# EasyEDA Pro project ProPrj_table-monitor_2025-05-22.epro, schematic Schematic1

## Sheets
1 USBC: Board Name: MainBoard; Create Date: 2025-04-15; Page Name: USBC; Project Name: table-monitor; Schematic Name: Schematic1; Update Date: 2025-04-30; Company: 嘉立创EDA; Page Size: A4; Version: V1.0
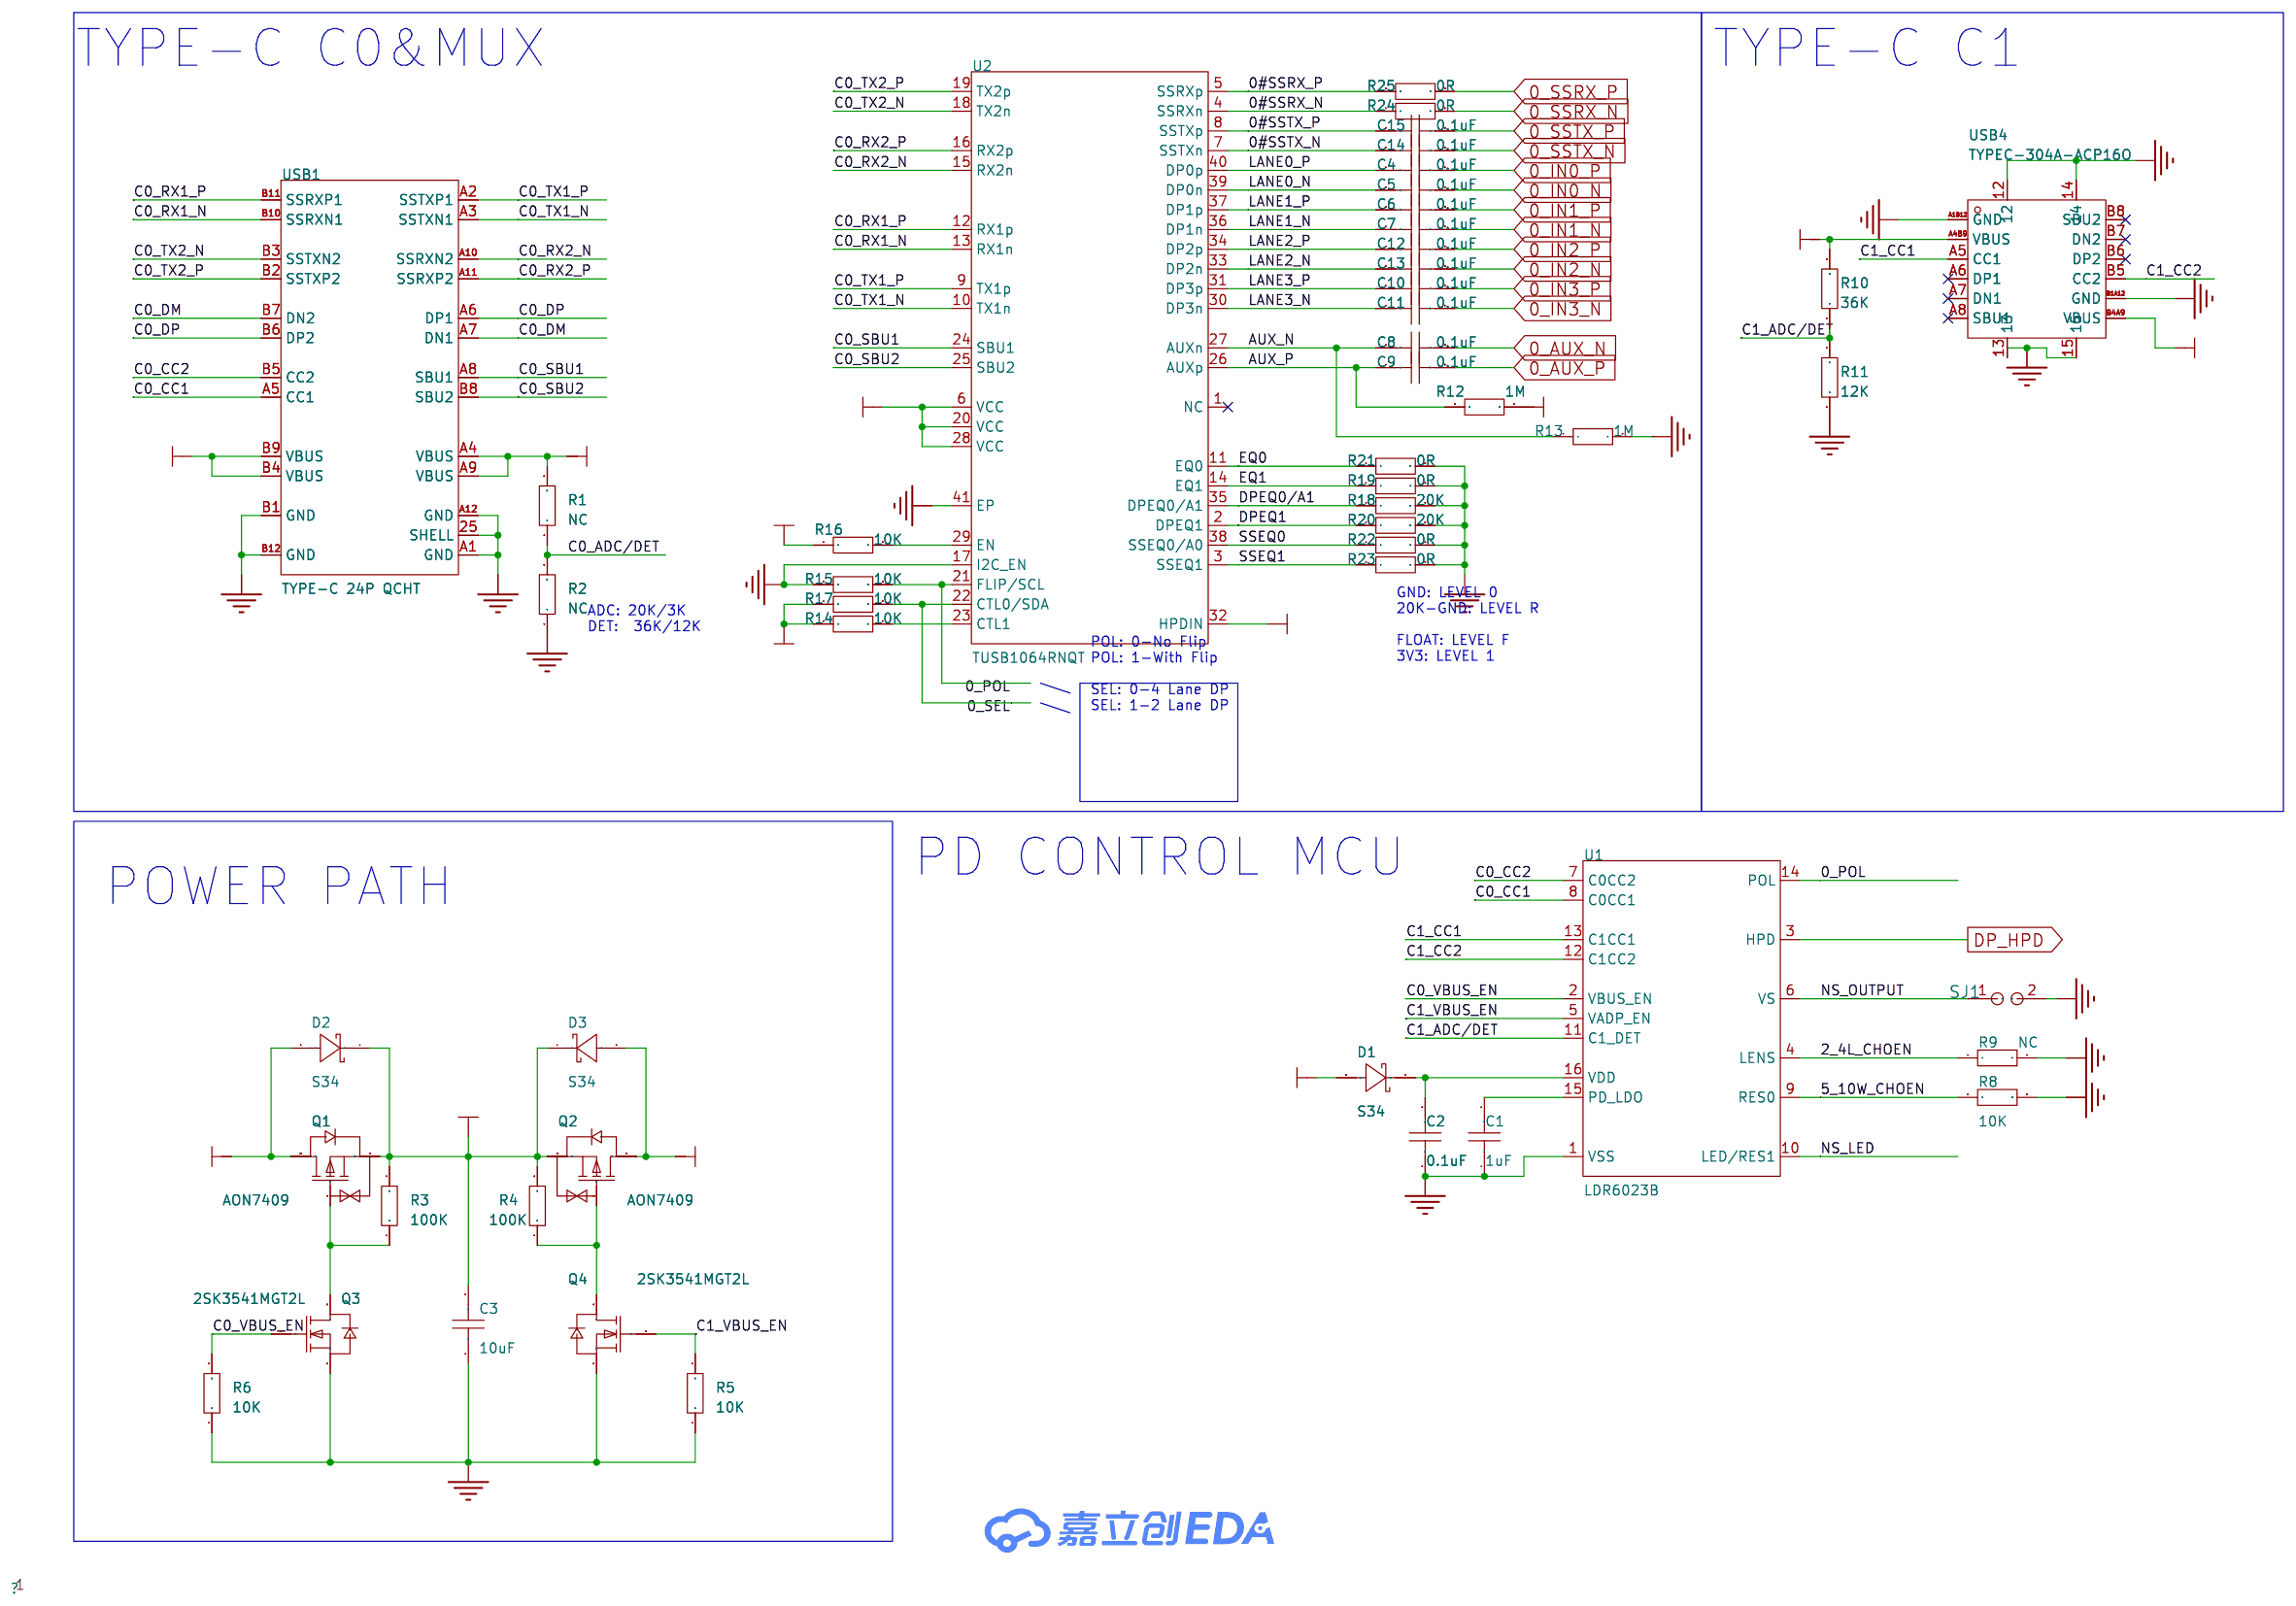
[diagram p1: USBC]
2 DP-MIPI: Create Date: 2025-04-22; Page Name: DP-MIPI
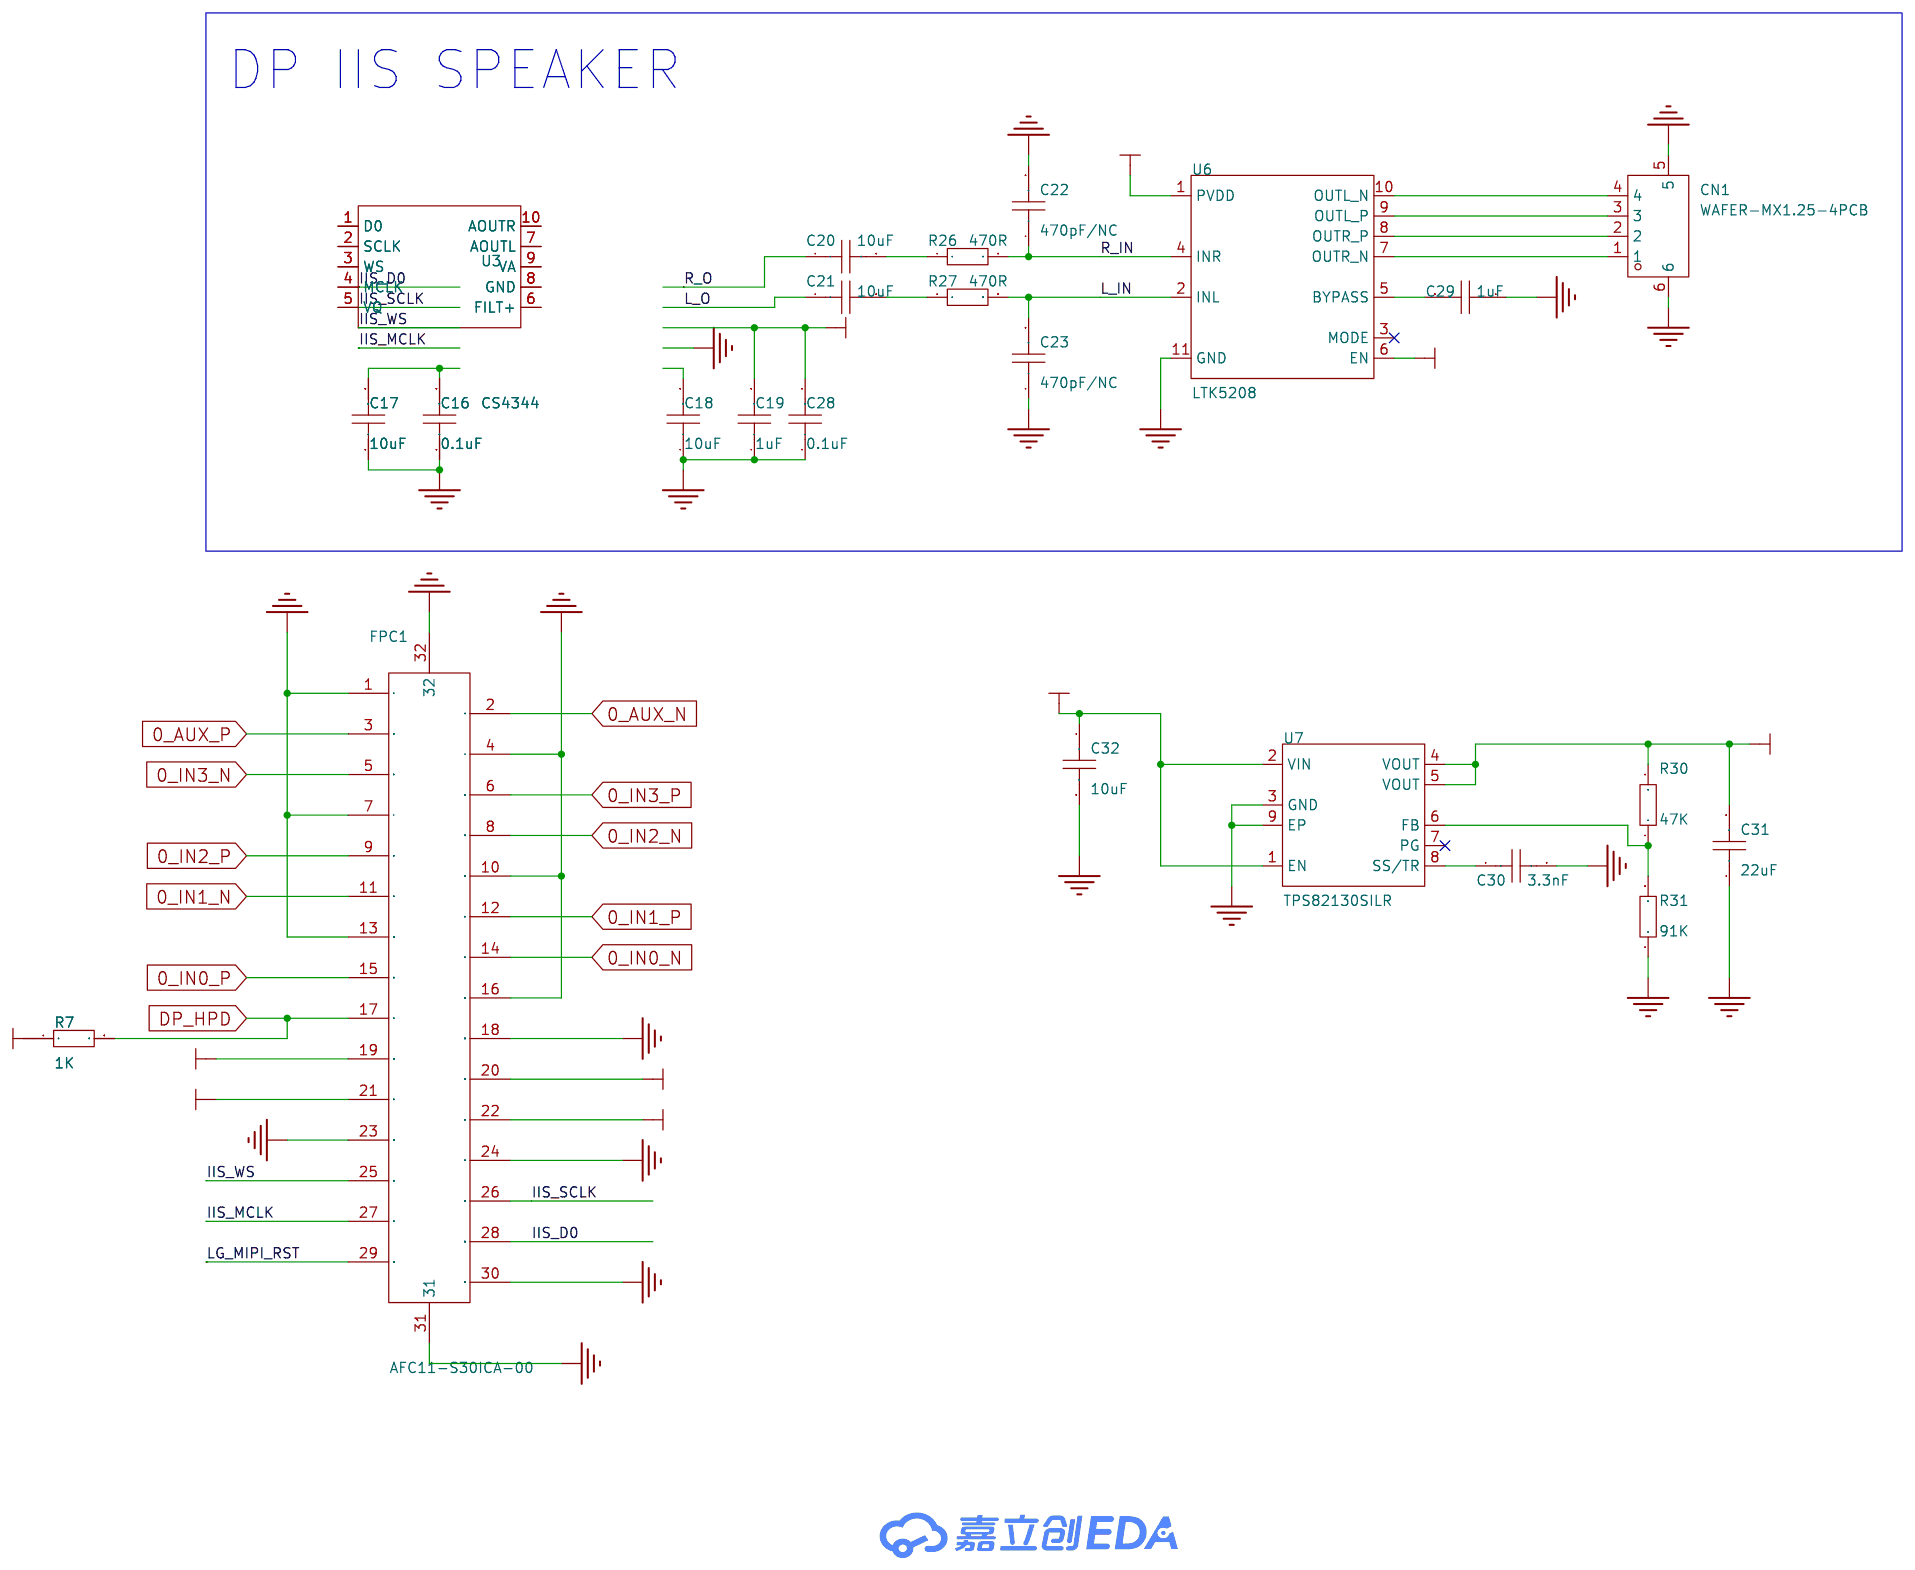
[diagram p2: DP-MIPI]
3 HUB: Create Date: 2025-04-22; Page Name: HUB; Update Date: 2025-05-07
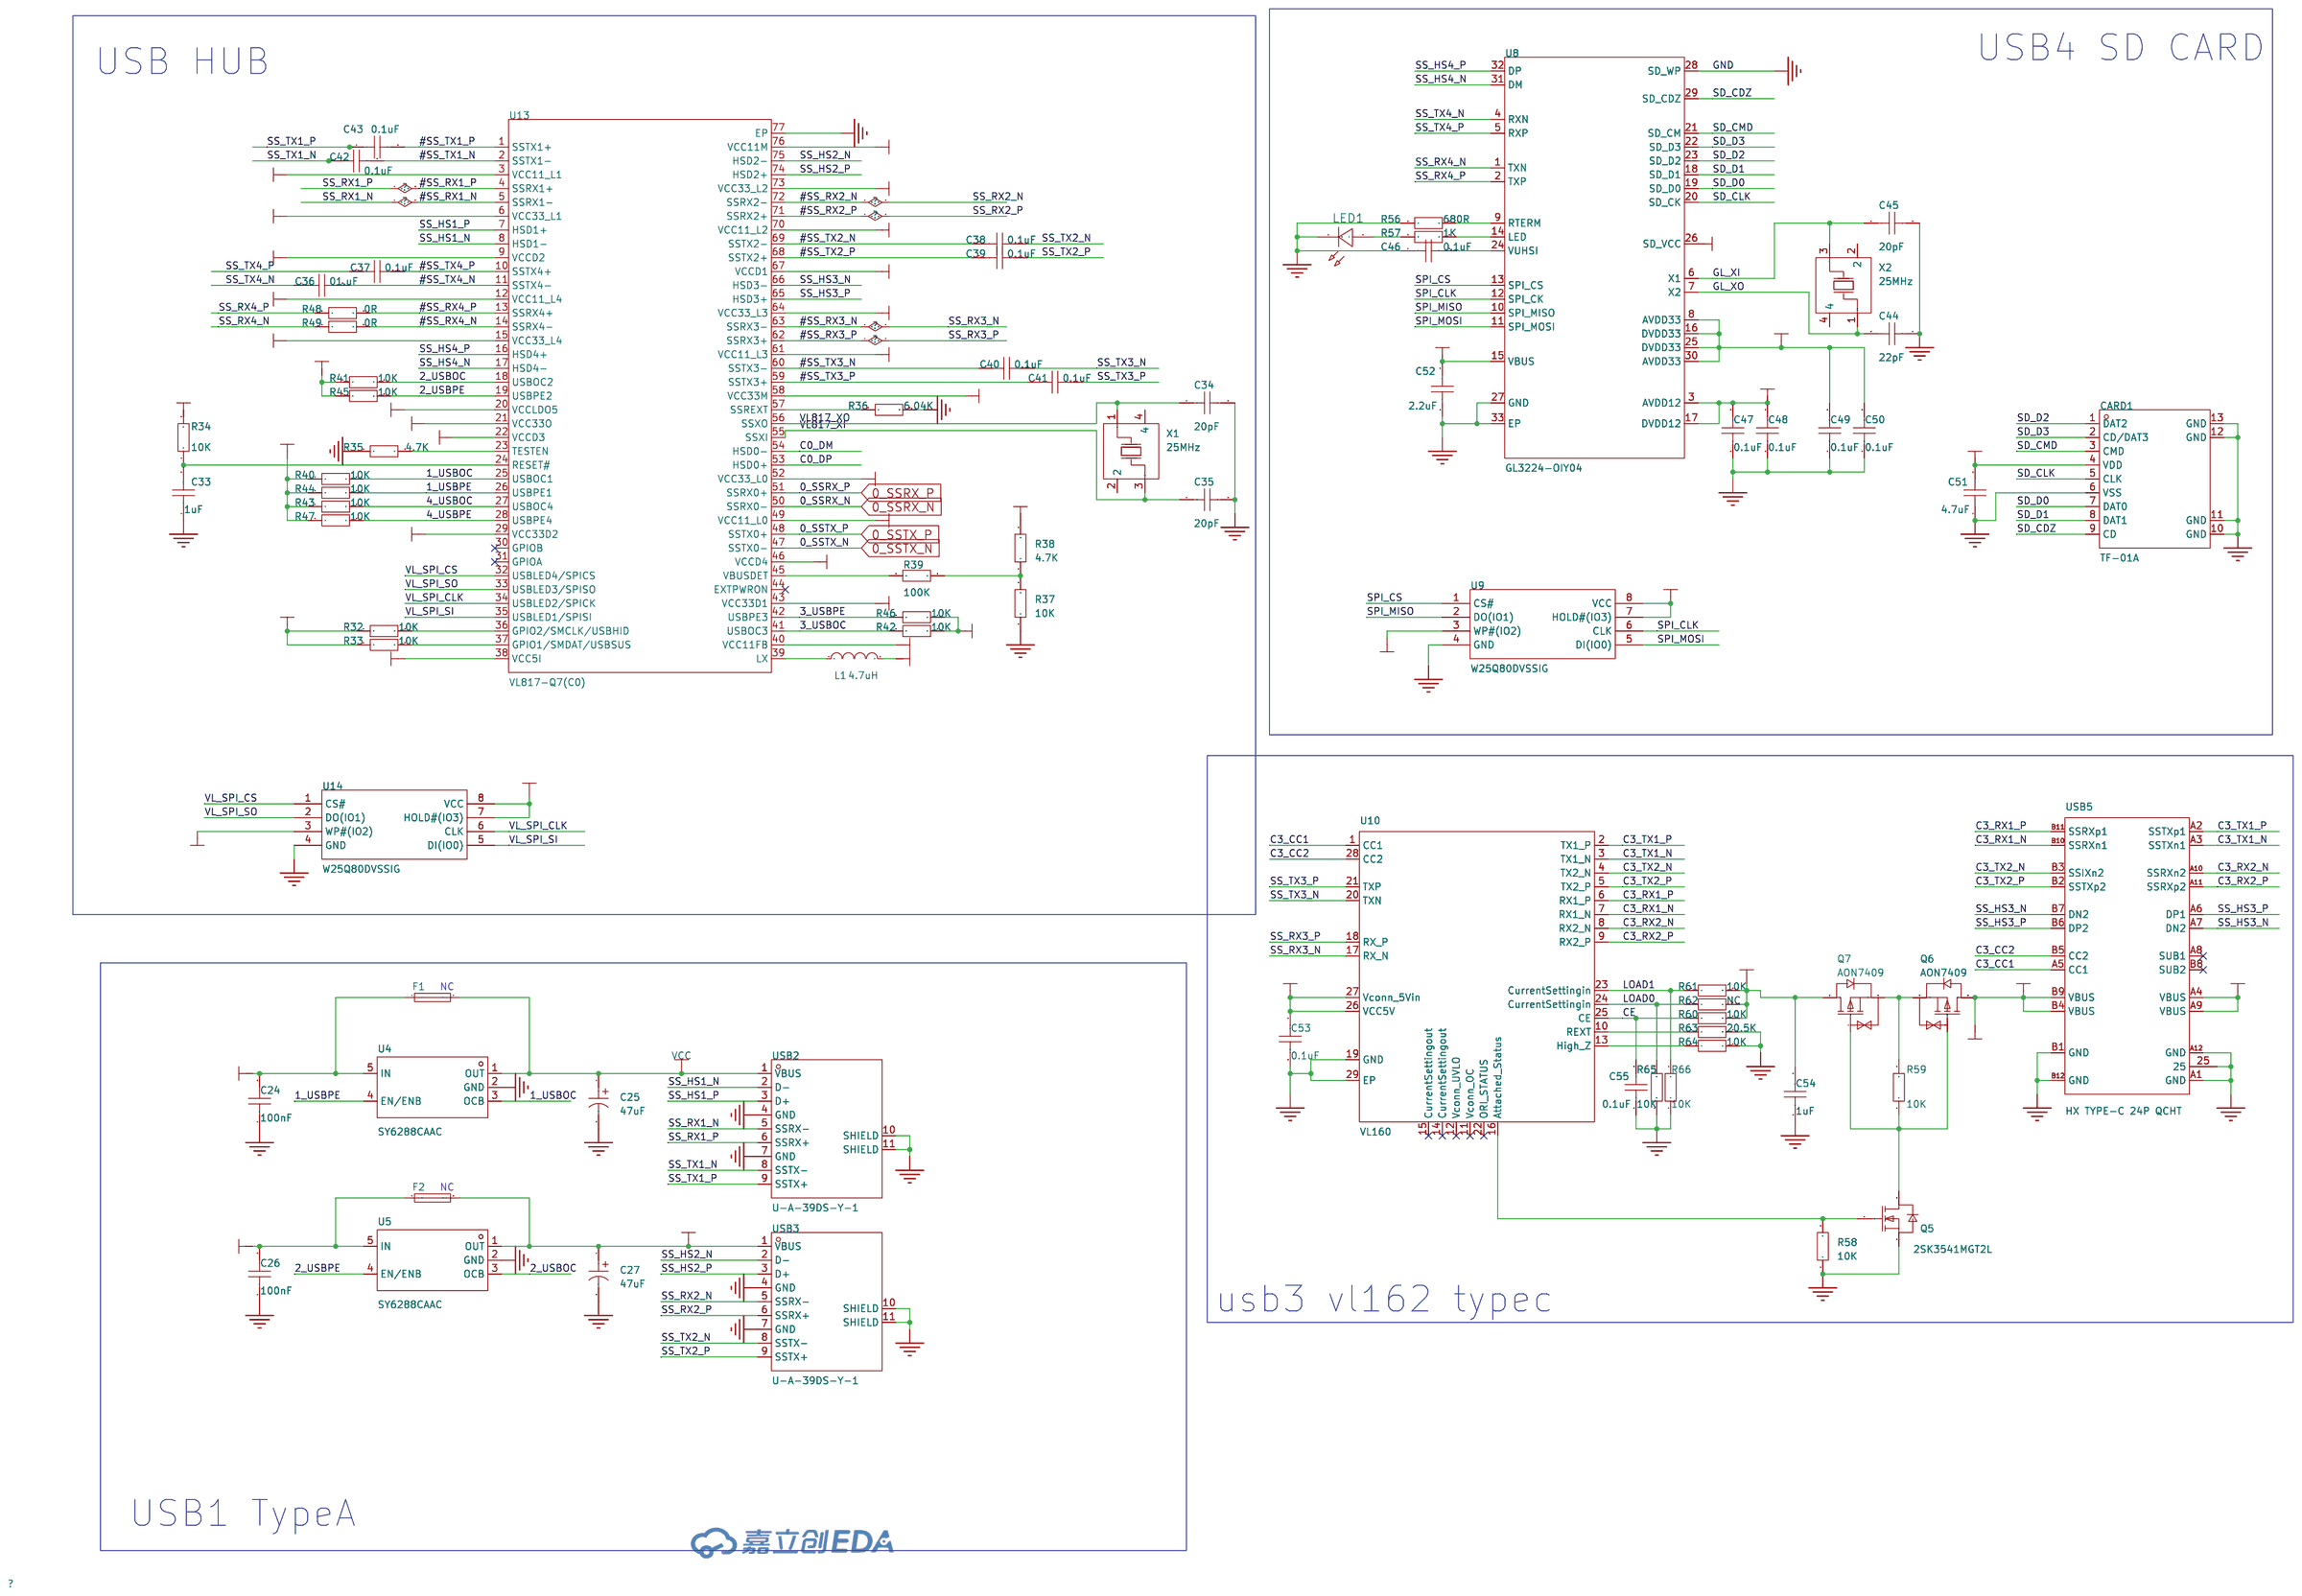
[diagram p3: HUB]
4 POWER: Create Date: 2025-04-22; Page Name: POWER
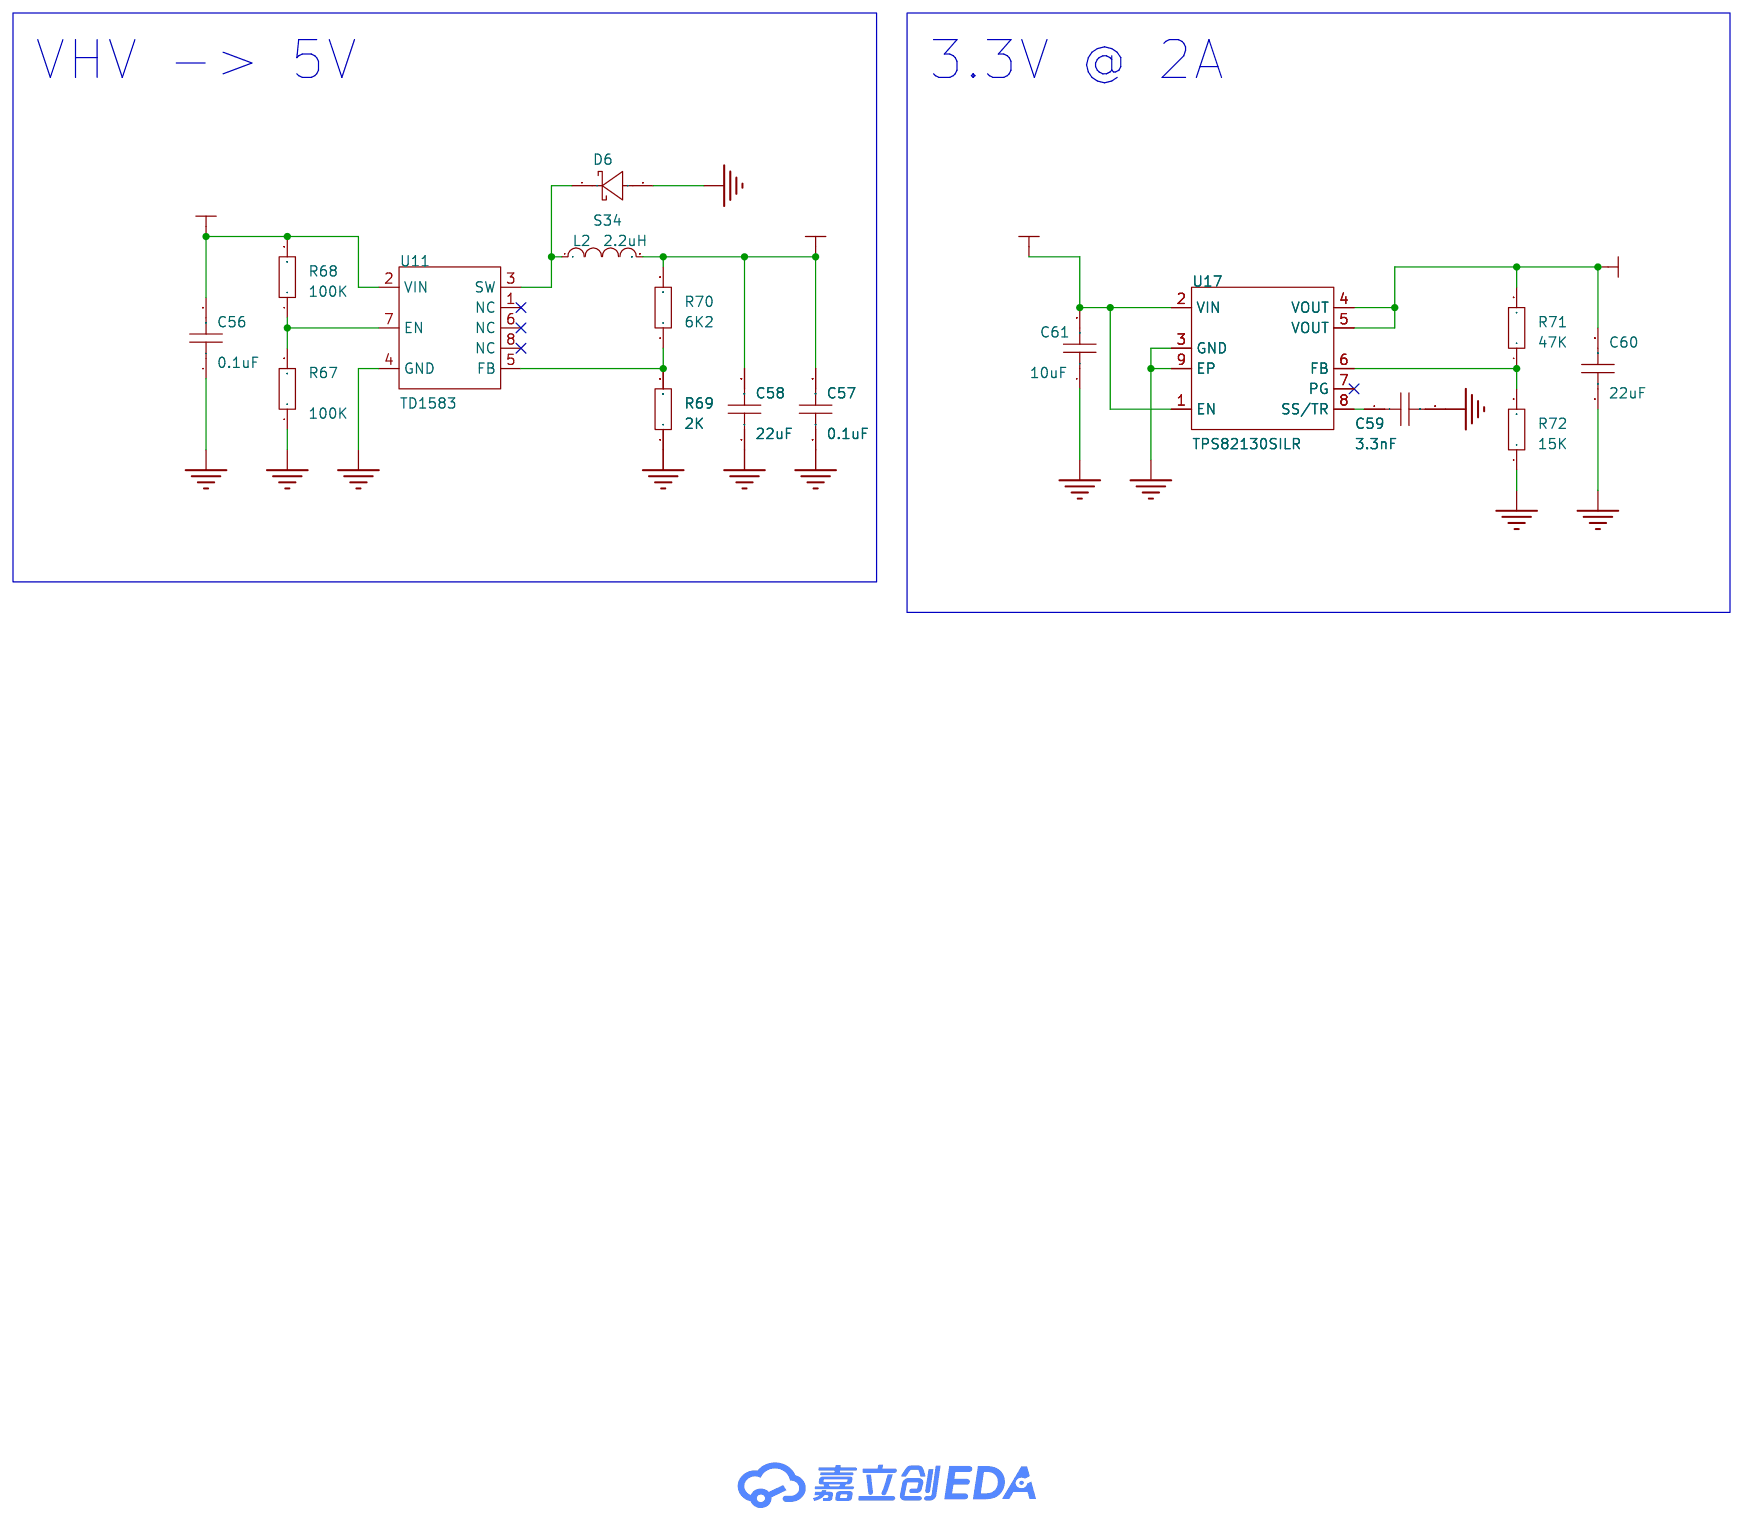
[diagram p4: POWER]

## Parts
sheet DP-MIPI
C16  0.1uF  [C0402]
C17  10uF  [C0402]
C18  10uF  [C0603]
C19  1uF  [C0603]
C20  10uF  [C0402]
C21  10uF  [C0402]
C22  470pF/NC  [C0402]
C23  470pF/NC  [C0402]
C28  0.1uF  [C0402]
C29  1uF  [C0402]
C30  3.3nF  [C0402]
C31  22uF  [C0805]
C32  10uF  [C0805]
CN1  WAFER-MX1.25-4PCB  [CONN-SMD_4P-P1.25_A1253WR-S-04PD01]
FPC1  AFC11-S30ICA-00  [CONN-SMD-30P_AFC11-S30ICA-00]
R7  1K  [R0603]
R26  470R  [R0402]
R27  470R  [R0402]
R30  47K  [R0402]
R31  91K  [R0402]
U3  CS4344  [TSSOP-10_L3.0-W3.0-P0.50-LS4.9-BL]
U6  LTK5208  [ESOP-10_L4.9-W3.9-P1.00-LS6.1-BL-EP]
U7  TPS82130SILR  [USIP-8_L3.0-W2.8-P0.65-TL-EP]
sheet HUB
C24  100nF  [C0402]
C25  47uF  [CAP-SMD_L3.5-W2.8-FD]
C26  100nF  [C0402]
C27  47uF  [CAP-SMD_L3.5-W2.8-FD]
C33  1uF  [C0402]
C34  20pF  [C0402]
C35  20pF  [C0402]
C36  01.uF  [C0402]
C37  0.1uF  [C0402]
C38  0.1uF  [C0402]
C39  0.1uF  [C0402]
C40  0.1uF  [C0402]
C41  0.1uF  [C0402]
C42  0.1uF  [C0402]
C43  0.1uF  [C0402]
C44  22pF  [C0402]
C45  20pF  [C0402]
C46  0.1uF  [C0402]
C47  0.1uF  [C0402]
C48  0.1uF  [C0402]
C49  0.1uF  [C0402]
C50  0.1uF  [C0402]
C51  4.7uF  [C0402]
C52  2.2uF  [C0402]
C53  0.1uF  [C0402]
C54  1uF  [C0603]
C55  0.1uF  [C0402]
CARD1  TF-01A  [TF-SMD_TF-02]
F1  -  [F1812]
F2  -  [F1812]
L1  4.7uH  [IND-SMD_L2.5-W2.0]
LED1  -  [LED_0603]
Q5  2SK3541MGT2L  [SOT-723-3_L1.2-W0.8-P0.80-LS1.2-BR]
Q6  AON7409  [DFN-8_L3.0-W3.0-P0.65-BL]
Q7  AON7409  [DFN-8_L3.0-W3.0-P0.65-BL]
R32  10K  [R0402]
R33  10K  [R0402]
R34  10K  [R0402]
R35  4.7K  [R0402]
R36  6.04K  [R0402]
R37  10K  [R0402]
R38  4.7K  [R0402]
R39  100K  [R0402]
R40  10K  [R0402]
R41  10K  [R0402]
R42  10K  [R0402]
R43  10K  [R0402]
R44  10K  [R0402]
R45  10K  [R0402]
R46  10K  [R0402]
R47  10K  [R0402]
R48  0R  [R0402]
R49  0R  [R0402]
R56  680R  [R0402]
R57  1K  [R0402]
R58  10K  [R0402]
R59  10K  [R0402]
R60  10K  [R0402]
R61  10K  [R0402]
R62  NC  [R0402]
R63  20.5K  [R0402]
R64  10K  [R0402]
R65  10K  [R0402]
R66  10K  [R0402]
U4  SY6288CAAC  [SOT-23-5_L3.0-W1.7-P0.95-LS2.8-BR]
U5  SY6288CAAC  [SOT-23-5_L3.0-W1.7-P0.95-LS2.8-BR]
U8  GL3224-OIY04  [HQFN-32_L5.0-W5.0-P0.50-BL-EP3.0]
U9  W25Q80DVSSIG  [SOIC-8_L5.3-W5.3-P1.27-LS8.0-BL]
U10  VL160  [MQFN-28_L4.5-W3.5-P0.40-BL-EP]
U13  VL817-Q7(C0)  [QFN-76_L9.0-W9.0-P0.40-EP6.3-TL]
U14  W25Q80DVSSIG  [SOIC-8_L4.9-W3.9-P1.27-LS6.0-BL]
USB2  U-A-39DS-Y-1  [USB-3.0-SMD_U-A-39DS-Y-1]
USB3  U-A-39DS-Y-1  [USB-3.0-SMD_U-A-39DS-Y-1]
USB5  HX TYPE-C 24P QCHT  [TYPE-C-SMD_TYPE-C-24P-QCHT]
X1  25MHz  [CRYSTAL-SMD_4P-L2.5-W2.0-BL]
X2  25MHz  [CRYSTAL-SMD_4P-L2.5-W2.0-BL]
sheet POWER
C56  0.1uF  [C0402]
C57  0.1uF  [C0402]
C58  22uF  [C0402]
C59  3.3nF  [C0402]
C60  22uF  [C0805]
C61  10uF  [C0805]
D6  S34  [SOD-123FL_L2.7-W1.8-LS3.8-RD]
L2  2.2uH  [IND-SMD_L4.5-W4.0_SCD0403T]
R67  100K  [R0402]
R68  100K  [R0402]
R69  2K  [R0402]
R70  6K2  [R0402]
R71  47K  [R0402]
R72  15K  [R0402]
U11  TD1583  [SOP-8_L4.9-W3.9-P1.27-LS6.0-BL]
U17  TPS82130SILR  [USIP-8_L3.0-W2.8-P0.65-TL-EP]
sheet USBC
C1  1uF  [C0402]
C2  0.1uF  [C0402]
C3  10uF  [C0402]
C4  0.1uF  [C0402]
C5  0.1uF  [C0402]
C6  0.1uF  [C0402]
C7  0.1uF  [C0402]
C8  0.1uF  [C0402]
C9  0.1uF  [C0402]
C10  0.1uF  [C0402]
C11  0.1uF  [C0402]
C12  0.1uF  [C0402]
C13  0.1uF  [C0402]
C14  0.1uF  [C0402]
C15  0.1uF  [C0402]
D1  S34  [SOD-123FL_L2.7-W1.8-LS3.8-RD]
D2  S34  [SOD-123FL_L2.7-W1.8-LS3.8-RD]
D3  S34  [SOD-123FL_L2.7-W1.8-LS3.8-RD]
Q1  AON7409  [DFN-8_L3.0-W3.0-P0.65-BL]
Q2  AON7409  [DFN-8_L3.0-W3.0-P0.65-BL]
Q3  2SK3541MGT2L  [SOT-723-3_L1.2-W0.8-P0.80-LS1.2-BR]
Q4  2SK3541MGT2L  [SOT-723-3_L1.2-W0.8-P0.80-LS1.2-BR]
R1  NC  [R0402]
R2  NC  [R0402]
R3  100K  [R0402]
R4  100K  [R0402]
R5  10K  [R0402]
R6  10K  [R0402]
R8  10K  [R0402]
R9  NC  [R0402]
R10  36K  [R0402]
R11  12K  [R0402]
R12  1M  [R0402]
R13  1M  [R0402]
R14  10K  [R0402]
R15  10K  [R0402]
R16  10K  [R0402]
R17  10K  [R0402]
R18  20K  [R0402]
R19  0R  [R0402]
R20  20K  [R0402]
R21  0R  [R0402]
R22  0R  [R0402]
R23  0R  [R0402]
R24  0R  [R0402]
R25  0R  [R0402]
SJ1  -  [TOGO_MODE]
U1  LDR6023B  [SSOP-16_L5.0-W4.4-P0.65-LS6.4-BL]
U2  TUSB1064RNQT  [WQFN-40_L6.0-W4.0-P0.40-TL-EP]
USB1  TYPE-C 24P QCHT  [TYPE-C-SMD_TYPE-C-24P-QCHT]
USB4  TYPEC-304A-ACP16O  [USB-SMD_TYPEC-304A-ACP16O]

## Library data of the parts
C1-C24 C26 C28-C61 = CAP_0603: Supplier Footprint: 0603
CN1 = WAFER-MX1.25-4PCB: 插针结构:1x4P;间距:1.25mm;安装方式:卧贴;总PIN数:4P;排数:1;每排PIN数:4;额定电流:1A;工作温度范围:-25℃~+85℃;; LCSC Part Name: 1x4P 间距:1.25mm 卧贴 黑金; Supplier Part: C3029388; Manufacturer: XUNPU(讯普); Supplier Footprint: SMD,P=1.25mm,卧贴; JLCPCB Part Class: Extended Part; Datasheet: https://atta.szlcsc.com/upload/public/pdf/source/20220527/DF508E36F492A21EC16A4954092B1486.pdf; Supplier: LCSC; Pins Structure: 1x4P; Pitch: 1.25mm; Mounting Style: 卧贴; Number of Pins: 4P; Number of Rows: 1; Number of PINs Per Row: 4; Current Rating (Max): 1A; Operating Temperature Range: -25℃~+85℃
FPC1 = AFC11-S30ICA-00: 锁定特性:抽屉式;触点类型:单侧触点/垂直;触点数量:30P;间距:0.5mm;安装类型:立贴;; LCSC Part Name: 间距:0.5mm P数:30P 抽屉式 单侧触点/垂直; Supplier Part: C262505; Manufacturer: JS(钜硕电子); Supplier Footprint: SMD,P=0.5mm; JLCPCB Part Class: 扩展库; Datasheet: https://atta.szlcsc.com/upload/public/pdf/source/20191211/C466537_F6F2472ADACFFA77E875AFE9DAB8E0AD.pdf; Supplier: LCSC; Locking Feature: 抽屉式; Contact Type: 单侧触点/垂直; Number of Contacts: 30P; Pitch: 0.5mm; Mounting Type: 立贴; FFC, FCB Thickness: 0.3mm; Height Above Board: 4.4mm
R1-R27 R30-R49 R56-R72 = Res_0603: Supplier Footprint: 0603
U3 = CS4344: Supplier: LCSC; Supplier Part: C2914311; JLCPCB Part Class: Extended Part
U6 = LTK5208: Supplier: LCSC; Supplier Part: C2920780; Supplier Footprint: ESOP-10-EP-150mil; JLCPCB Part Class: Extended Part
U7 U17 = TPS82130: 输入电压(DC):3V~17V;输出电压:900mV~6V;输出电流(最大值):3A;功能类型:-;; Supplier: LCSC; Supplier Part: C473914; Manufacturer: TI(德州仪器); JLCPCB Part Class: Extended Part; Supplier Footprint: USIP-8; Datasheet: https://www.ti.com/cn/lit/gpn/tps82130; Input Voltage(DC): 3V~17V; Output Voltage: 900mV~6V; Output Current (Max): 3A; Output Channel: 1
C25 C27 = CA45A-B-16V-47UF-M: 容值:47uF;精度:±20%;额定电压:16V;工作温度:-55℃~+125℃;; LCSC Part Name: 47uF ±20% 16V; Supplier Part: C2976930; Manufacturer: CEC(振华新云); Supplier Footprint: SMD,3.5x2.8x1.9mm; JLCPCB Part Class: 扩展库; Datasheet: https://atta.szlcsc.com/upload/public/pdf/source/20220222/C2C5F368BEBB90E653B4407F98E5644A.pdf; Supplier: LCSC; Tolerance: ±20%; Rated Voltage: 16V; Operating Temperature: -55℃~+125℃
CARD1 = TF-01A_C2889258: 卡连接方式:自弹式;卡类型:MicroSD卡(TF卡);连接器类型:卡座;本体最大高度:2mm;工作温度范围:-;; LCSC Part Name: 自弹式 MicroSD卡(TF卡) 卡座; Supplier Part: C2889258; Manufacturer: Yuandi(元迪); Supplier Footprint: SMD; JLCPCB Part Class: 扩展库; Datasheet: https://atta.szlcsc.com/upload/public/pdf/source/20210830/44259D2B93BF4B637A446EF1520C4989.pdf; Supplier: LCSC; Card Connection Mode: 自弹式; Card Type: MicroSD卡(TF卡); Connector Type: 卡座; Maximum Body Height: 2mm
F1 F2 = TLC-MSMD250/14: 最大电压:14V;最大电流:100A;保持电流:2.5A;跳闸电流:5A;消耗功率:1.2W;初始态阻值(最小值):-;跳断后阻值(最大值):-;最大动作时间:5s;工作温度:-40℃~+85℃;; LCSC Part Name: 181214V2.5A; Supplier Part: C381482; Manufacturer: TLC(竞沃); Supplier Footprint: 1812; JLCPCB Part Class: ExtendedPart; Datasheet: https://atta.szlcsc.com/upload/public/pdf/source/20190327/C381482_5C94C4764A4617A5537C56F870DA250C.pdf; Supplier: NC; Operating Voltage (Max): 14V; Current Rating (Max): 100A; Hold Current: 2.5A; Trip Current: 5A; Power Dissipation: 1.2W; Maximum Time to Trip: 5s; Operating Temperature: -40℃~+85℃
L1 L2 = L_0603: Supplier Footprint: L0603
LED1 = LED_0603-R: Supplier Footprint: 0603
Q3-Q5 = 2SK3541MGT2L: LCSC Part Name: 2SK3541MGT2L 停产; Supplier Part: C5160967; Manufacturer: ROHM(罗姆); JLCPCB Part Class: 扩展库; Supplier: LCSC
Q1 Q2 Q6 Q7 = AON7409: Supplier: LCSC; Supplier Part: C189753; Manufacturer: Alpha & Omega Semicon; JLCPCB Part Class: Extended Part
U4 U5 = SY6288CAAC: Supplier Part: C111830; Manufacturer: 矽力杰silergy; Supplier Footprint: SOT-23-5; JLCPCB Part Class: 扩展库; Datasheet: https://atta.szlcsc.com/upload/public/pdf/source/20170810/C111830_1502335157935879678.pdf; Supplier: LCSC
U8 = GL3224-OIY04: 应用功能:-;接口协议:-;; Supplier Part: C157357; Manufacturer: GENESYS(创惟); Supplier Footprint: QFN-32-EP(5x5); JLCPCB Part Class: 扩展库; Datasheet: https://atta.szlcsc.com/upload/public/pdf/source/20230517/B5096226B024C9DA93B699CE6C50AA13.pdf; Supplier: LCSC
U9 U14 = W25Q80DVSSIG_C14086: 接口类型:SPI;存储容量:8Mbit;; Supplier Part: C14086; Manufacturer: WINBOND(华邦); Supplier Footprint: SOIC-8-208mil; JLCPCB Part Class: 扩展库; Datasheet: https://atta.szlcsc.com/upload/public/pdf/source/20170421/1492769668655.pdf; Supplier: LCSC; Interface Type: SPI; Memory Size: 8Mbit; Supply Voltage: 2.7V~3.6V; Page Programming Time (Tpp): 3ms; Operating Temperature: -40℃~+85℃
U10 = VL160: 类型:-;协议类别:-;驱动器/接收器数:-;数据速率:-;; Supplier Part: C2841472; Supplier Footprint: MQFN-28; JLCPCB Part Class: Extended Part; Datasheet: https://atta.szlcsc.com/upload/public/pdf/source/20210707/C2841472_23203D4DC0B460F77735B81667EEBB6C.pdf; Supplier: LCSC
U13 = VL817-Q7(C0): Supplier Part: C29780427; Manufacturer: VIA Labs(威锋电子); Supplier Footprint: QFN-76L(9x9); JLCPCB Part Class: 扩展库; Datasheet: https://atta.szlcsc.com/upload/public/pdf/source/20240717/6DF43B0DF0EE752D05B176EB20D46AC7.pdf; Supplier: LCSC
USB2 USB3 = U-A-39DS-Y-1: 连接器类型:Type-A;标准:USB 3.0;公母:母;端口数量:1;触点数量:9P;安装方式:卧贴;额定电流 - 电源:1A;工作温度范围:-;; LCSC Part Name: Type-A 母 卧贴; Supplier Part: C840354; Manufacturer: 韩国韩荣; Supplier Footprint: SMD; JLCPCB Part Class: 扩展库; Datasheet: https://atta.szlcsc.com/upload/public/pdf/source/20210810/F9FE74E6AA3B768F31800618C9FE3C9E.pdf; Supplier: LCSC; Connector Type: Type-A; Standard: USB 3.0; Gender: 母; Number of Ports: 1; Number of Contacts: 9P; Mounting Style: 卧贴; Current Rating - Power (Max): 1A
USB5 = HX TYPE-C 24P QCHT: 连接器类型:Type-C;标准:USB 3.1;公母:母;安装方式:卧贴;触点数量:16P;端口数量:1;额定电流 - 电源:5A;工作温度范围:-30℃~+80℃;; LCSC Part Name: Type-C 母 卧贴; Supplier Part: C5178545; Manufacturer: hanxia(韩下); Supplier Footprint: SMD; JLCPCB Part Class: 扩展库; Datasheet: https://atta.szlcsc.com/upload/public/pdf/source/20220920/59AC43AA2FE66A72371D54E17EF43F69.pdf; Supplier: LCSC; Connector Type: Type-C; Standard: USB 3.1; Gender: 母; Mounting Style: 卧贴; Number of Contacts: 16P; Number of Ports: 1; Current Rating - Power (Max): 5A; Rated Voltage (Max): 20V; Connect-Disconnect Life: 1万次; Length: 9.87mm; Core Colour: 黑色; Operating Temperature Range: -30℃~+80℃
X1 X2 = TXM25M0004252KBCEO00T: 晶振类型:贴片晶振;频率:25MHz;常温频差:±10ppm;负载电容:18pF;频率稳定度:±30ppm;; LCSC Part Name: 25MHz ±10ppm 18pF; Supplier Part: C284165; Manufacturer: YJX(雅晶鑫); Supplier Footprint: SMD2520-4P; JLCPCB Part Class: 扩展库; Datasheet: https://atta.szlcsc.com/upload/public/pdf/source/20180910/C284165_DA27AC989E7A43F90AE1A3E7119C6030.pdf; Supplier: LCSC; Type: 贴片晶振; Normal temperature Frequency Tolerance: ±10ppm; Load Capacitance: 18pF; Frequency Stability: ±30ppm; Equivalent Series Resistance(ESR): 45Ω; Operating Temperature: -40℃~+85℃
D1-D3 D6 = S34_C698816: 二极管配置:独立式;正向压降(Vf):500mV@3A;直流反向耐压(Vr):40V;平均整流电流(Io):3A;; LCSC Part Name: 电压:40V 电流:3A; Supplier Part: C698816; Manufacturer: YANGJIE(扬杰); Supplier Footprint: SOD-123; JLCPCB Part Class: Extended Part; Datasheet: https://atta.szlcsc.com/upload/public/pdf/source/20200709/C698815_1D207AC1CC63E2E03D733B95FE7C070C.pdf; Supplier: LCSC; Diode Configuration: 独立式; Forward Voltage (Vf@If): 500mV@3A; Reverse Voltage (Vr): 40V; Average Rectified Current (Io): 3A; Reverse Leakage Current (Ir): 500uA@40V
U11 = TD1583: Supplier Part: C9900001157; Supplier Footprint: SOP-8(4.9x3.9x1.27); JLCPCB Part Class: 扩展库; Datasheet: 2021-10-28/37771S/91628cc0d77f42ac86203c509ec9a6ab/TD1583.pdf; Supplier: LCSC
SJ1 = JUMP: Pin Type: IN
U1 = LDR6023A/B: LCSC Part Name: 满足Switch游戏机投屏同时最高20V充电; Supplier Part: C2919627; Manufacturer: Legendary(乐得瑞); Supplier Footprint: SSOP-16-4.4mm; JLCPCB Part Class: Extended Part; Datasheet: https://atta.szlcsc.com/upload/public/pdf/source/20211112/E18ACFF8FAF23971BF5C63AF910BDD6B.pdf; Supplier: LCSC; Applications Function: USB充电芯片; Protocol: PD; Number of Channels: 2; Supply Voltage: 3.3V~5V; Operating Temperature: -45℃~+85℃
U2 = TUSB1064: 应用功能:驱动器；缓冲器;; Supplier: LCSC; Supplier Part: C2652412; Manufacturer: TI(德州仪器); JLCPCB Part Class: 扩展库; Supplier Footprint: QFN-40-EP(4x6); Datasheet: https://www.ti.com/cn/lit/gpn/tusb1064; Applications Function: 驱动器；缓冲器
USB1 = TYPE-C 3.1 24P: 连接器类型:Type-C;标准:-;公母:母座;触点数量:24;端口数量:1;安装方式:卧贴;额定电流 - 电源:3A;工作温度范围:-40℃~+85℃;; Manufacturer: SHOU HAN(首韩); Supplier: LCSC; Supplier Part: C456013; Mounting Style: 卧贴; Number of Contacts: 24; Number of Ports: 1; Current Rating - Power (Max): 3A; Operating Temperature Range: -40℃~+85℃; Gender: 母座; Supplier Footprint: SMD; JLCPCB Part Class: Extended Part; LCSC Part Name: Type-C 母座 卧贴 双排前叉后贴带定位柱有后盖四脚端子; Connector Type: Type-C; Datasheet: https://atta.szlcsc.com/upload/public/pdf/source/20191113/C456013_92427D6B1C851D10A4627E39D5976A1B.pdf
USB4 = TYPEC-304A-ACP16O: 连接器类型:Type-C;标准:USB 3.1;公母:母;安装方式:卧贴;触点数量:16P;端口数量:1;额定电流 - 电源:-;工作温度范围:-45℃~+85℃;; LCSC Part Name: Type-C 母 卧贴; Supplier Part: C2909610; Manufacturer: XUNPU(讯普); Supplier Footprint: SMD; JLCPCB Part Class: 扩展库; Datasheet: https://atta.szlcsc.com/upload/public/pdf/source/20211029/5A76838C591B377E5BF09726BF37DE5A.pdf; Supplier: LCSC; Connector Type: Type-C; Standard: USB 3.1; Gender: 母; Mounting Style: 卧贴; Number of Contacts: 16P; Number of Ports: 1; Operating Temperature Range: -45℃~+85℃

## Nets
GND: C1.1 C2.1 C3.1 C16.1 C17.1 C18.1 C19.1 C22.2 C23.1 C24.1 C25.2 C26.1 C27.2 C28.1 C29.1 C30.2 C31.1 C32.2 C33.1 C34.2 C35.2 C44.1 C45.1 C46.1 C47.1 C48.1 C49.1 C50.1 C51.1 C52.1 C53.2 C54.1 C55.1 C56.1 C57.1 C58.1 C59.2 C60.1 C61.1 CARD1.6(VSS) CARD1.10(GND) CARD1.11(GND) CARD1.12(GND) CARD1.13(GND) CN1.5 CN1.6 D6.2(A) FPC1.1 FPC1.4 FPC1.7 FPC1.10 FPC1.13 FPC1.16 FPC1.18 FPC1.23 FPC1.24 FPC1.30 FPC1.31 FPC1.32 LED1.1(C) Q3.2(S) Q4.2(S) Q5.2(S) R2.1 R5.1 R6.1 R8.2 R9.2 R11.1 R13.2 R15.1 R18.2 R19.2 R20.2 R21.2 R22.2 R23.2 R31.1 R35.1 R36.2 R37.1 R56.1 R58.1 R63.2 R64.2 R65.1 R66.1 R67.1 R69.1 R72.1 SJ1.2 U1.1(VSS) U2.17(I2C_EN) U2.41(EP) U4.2(GND) U5.2(GND) U6.11(GND) U7.3(GND) U7.9(EP) U8.27(GND) U8.28(SD_WP) U8.33(EP) U9.4(GND) U10.19(GND) U10.29(EP) U11.4(GND) U13.77(EP) U14.4(GND) U17.3(GND) U17.9(EP) USB1.25(SHELL) USB1.A1(GND) USB1.A12(GND) USB1.B1(GND) USB1.B12(GND) USB2.4(GND) USB2.7(GND) USB2.10(SHIELD) USB2.11(SHIELD) USB3.4(GND) USB3.7(GND) USB3.10(SHIELD) USB3.11(SHIELD) USB4.12 USB4.13 USB4.14 USB4.15 USB4.A1B12(GND) USB4.B1A12(GND) USB5.25 USB5.A1(GND) USB5.A12(GND) USB5.B1(GND) USB5.B12(GND)
V33S: C19.2 C28.2 C60.2 FPC1.19 FPC1.20 R7.1 R12.2 R14.1 R16.1 R17.1 R32.1 R33.1 R34.2 R40.1 R41.1 R42.2 R43.1 R44.1 R45.1 R46.2 R47.1 R71.2 U2.6(VCC) U2.20(VCC) U2.28(VCC) U2.32(HPDIN) U6.1(PVDD) U6.6(EN) U17.4(VOUT) U17.5(VOUT)
VBUS2: C27.1 F2.2 U5.1(OUT) USB3.1(VBUS)
VCC: C25.1 F1.2 U4.1(OUT) USB2.1(VBUS)
0#SSRX_N: R24.1 U2.4(SSRXn)
0#SSRX_P: R25.1 U2.5(SSRXp)
0#SSTX_N: C14.1 U2.7(SSTXn)
0#SSTX_P: C15.1 U2.8(SSTXp)
0_AUX_N: C8.2 FPC1.2
0_AUX_P: C9.2 FPC1.3
0_IN0_N: C5.2 FPC1.14
0_IN0_P: C4.2 FPC1.15
0_IN1_N: C7.2 FPC1.11
0_IN1_P: C6.2 FPC1.12
0_IN2_N: C13.2 FPC1.8
0_IN2_P: C12.2 FPC1.9
0_IN3_N: C11.2 FPC1.5
0_IN3_P: C10.2 FPC1.6
0_POL: R15.2 U1.14(POL) U2.21(FLIP/SCL)
0_SEL: R17.2 U2.22(CTL0/SDA)
0_SSRX_N: R24.2 U13.50(SSRX0-)
0_SSRX_P: R25.2 U13.51(SSRX0+)
0_SSTX_N: C14.2 U13.47(SSTX0-)
0_SSTX_P: C15.2 U13.48(SSTX0+)
1_USBOC: R40.2 U4.3(OCB) U13.25(USBOC1)
1_USBPE: R44.2 U4.4(EN/ENB) U13.26(USBPE1)
2_4L_CHOEN: R9.1 U1.4(LENS)
2_USBOC: R41.2 U5.3(OCB) U13.18(USBOC2)
2_USBPE: R45.2 U5.4(EN/ENB) U13.19(USBPE2)
3_USBOC: R42.1 U13.41(USBOC3)
3_USBPE: R46.1 U13.42(USBPE3)
4_USBOC: R43.2 U13.27(USBOC4)
4_USBPE: R47.2 U13.28(USBPE4)
5_10W_CHOEN: R8.1 U1.9(RES0)
7911_V12: C31.2 FPC1.21 FPC1.22 R30.2 U7.4(VOUT) U7.5(VOUT)
#SS_RX1_N: U13.5(SSRX1-) USB2.5(SSRX-)
#SS_RX1_P: U13.4(SSRX1+) USB2.6(SSRX+)
#SS_RX2_N: U13.72(SSRX2-) USB3.5(SSRX-)
#SS_RX2_P: U13.71(SSRX2+) USB3.6(SSRX+)
#SS_RX3_N: U10.17(RX_N) U13.63(SSRX3-)
#SS_RX3_P: U10.18(RX_P) U13.62(SSRX3+)
#SS_RX4_N: R49.2 U13.14(SSRX4-)
#SS_RX4_P: R48.2 U13.13(SSRX4+)
#SS_TX1_N: C42.2 U13.2(SSTX1-)
#SS_TX1_P: C43.2 U13.1(SSTX1+)
#SS_TX2_N: C38.1 U13.69(SSTX2-)
#SS_TX2_P: C39.1 U13.68(SSTX2+)
#SS_TX3_N: C40.1 U13.60(SSTX3-)
#SS_TX3_P: C41.1 U13.59(SSTX3+)
#SS_TX4_N: C36.2 U13.11(SSTX4-)
#SS_TX4_P: C37.2 U13.10(SSTX4+)
AUX_N: C8.1 R13.1 U2.27(AUXn)
AUX_P: C9.1 R12.1 U2.26(AUXp)
BUS_5V: C24.2 C26.2 C32.1 C52.2 C53.1 C54.2 C57.2 C58.2 C61.2 D1.2(A) F1.1 F2.1 L2.2 Q7.5(D) Q7.6(D) Q7.7(D) Q7.8(D) Q7.9(D) R38.2 R60.2 R61.2 R62.2 R70.2 U4.5(IN) U5.5(IN) U7.1(EN) U7.2(VIN) U8.15(VBUS) U10.26(VCC5V) U10.27(Vconn_5Vin) U13.20(VCCLDO5) U13.38(VCC5I) U17.1(EN) U17.2(VIN)
C0_ADC/DET: R1.1 R2.2
C0_CC1: U1.8(C0CC1) USB1.A5(CC1)
C0_CC2: U1.7(C0CC2) USB1.B5(CC2)
C0_DM: U13.54(HSD0-) USB1.A7(DN1) USB1.B7(DN2)
C0_DP: U13.53(HSD0+) USB1.A6(DP1) USB1.B6(DP2)
C0_RX1_N: U2.13(RX1n) USB1.B10(SSRXN1)
C0_RX1_P: U2.12(RX1p) USB1.B11(SSRXP1)
C0_RX2_N: U2.15(RX2n) USB1.A10(SSRXN2)
C0_RX2_P: U2.16(RX2p) USB1.A11(SSRXP2)
C0_SBU1: U2.24(SBU1) USB1.A8(SBU1)
C0_SBU2: U2.25(SBU2) USB1.B8(SBU2)
C0_TX1_N: U2.10(TX1n) USB1.A3(SSTXN1)
C0_TX1_P: U2.9(TX1p) USB1.A2(SSTXP1)
C0_TX2_N: U2.18(TX2n) USB1.B3(SSTXN2)
C0_TX2_P: U2.19(TX2p) USB1.B2(SSTXP2)
C0_VBUS: D2.2(A) Q1.5(D) Q1.6(D) Q1.7(D) Q1.8(D) Q1.9(D) R1.2 USB1.A4(VBUS) USB1.A9(VBUS) USB1.B4(VBUS) USB1.B9(VBUS)
C0_VBUS_EN: Q3.1(G) R6.2 U1.2(VBUS_EN)
C1_ADC/DET: R10.1 R11.2 U1.11(C1_DET)
C1_CC1: U1.13(C1CC1) USB4.A5(CC1)
C1_CC2: U1.12(C1CC2) USB4.B5(CC2)
C1_VBUS: D3.2(A) Q2.5(D) Q2.6(D) Q2.7(D) Q2.8(D) Q2.9(D) R10.2 USB4.A4B9(VBUS) USB4.B4A9(VBUS)
C1_VBUS_EN: Q4.1(G) R5.2 U1.5(VADP_EN)
C3_CC1: U10.1(CC1) USB5.A5(CC1)
C3_CC2: U10.28(CC2) USB5.B5(CC2)
C3_RX1_N: U10.7(RX1_N) USB5.B10(SSRXn1)
C3_RX1_P: U10.6(RX1_P) USB5.B11(SSRXp1)
C3_RX2_N: U10.8(RX2_N) USB5.A10(SSRXn2)
C3_RX2_P: U10.9(RX2_P) USB5.A11(SSRXp2)
C3_TX1_N: U10.3(TX1_N) USB5.A3(SSTXn1)
C3_TX1_P: U10.2(TX1_P) USB5.A2(SSTXp1)
C3_TX2_N: U10.4(TX2_N) USB5.B3(SSIXn2)
C3_TX2_P: U10.5(TX2_P) USB5.B2(SSTXp2)
C3_VBUS: Q6.5(D) Q6.6(D) Q6.7(D) Q6.8(D) Q6.9(D) USB5.A4(VBUS) USB5.A9(VBUS) USB5.B4(VBUS) USB5.B9(VBUS)
CE: C55.2 R60.1 U10.25(CE)
DP_HPD: FPC1.17 R7.2 U1.3(HPD)
DPEQ0/A1: R18.1 U2.35(DPEQ0/A1)
DPEQ1: R20.1 U2.2(DPEQ1)
EQ0: R21.1 U2.11(EQ0)
EQ1: R19.1 U2.14(EQ1)
GL_1V2: C47.2 C48.2 U8.3(AVDD12) U8.17(DVDD12)
GL_3V3: C49.2 C50.2 U8.8(AVDD33) U8.16(DVDD33) U8.25(DVDD33) U8.30(AVDD33) U9.3(WP#(IO2)) U9.7(HOLD#(IO3)) U9.8(VCC)
GL_XI: C45.2 U8.6(X1) X2.3(OSC2)
GL_XO: C44.2 U8.7(X2) X2.1(OSC1)
IIS_D0: FPC1.28
IIS_MCLK: FPC1.27
IIS_SCLK: FPC1.26
IIS_WS: FPC1.25
L_IN: C23.2 R27.2 U6.2(INL)
L_O: C21.1
LANE0_N: C5.1 U2.39(DP0n)
LANE0_P: C4.1 U2.40(DP0p)
LANE1_N: C7.1 U2.36(DP1n)
LANE1_P: C6.1 U2.37(DP1p)
LANE2_N: C13.1 U2.33(DP2n)
LANE2_P: C12.1 U2.34(DP2p)
LANE3_N: C11.1 U2.30(DP3n)
LANE3_P: C10.1 U2.31(DP3p)
LG_MIPI_RST: FPC1.29
LOAD0: R62.1 R65.2 U10.24(CurrentSettingin)
LOAD1: R61.1 R66.2 U10.23(CurrentSettingin)
NS_LED: U1.10(LED/RES1)
NS_OUTPUT: SJ1.1 U1.6(VS)
R_IN: C22.1 R26.2 U6.4(INR)
R_O: C20.1
SD_CDZ: CARD1.9(CD) U8.29(SD_CDZ)
SD_CLK: CARD1.5(CLK) U8.20(SD_CK)
SD_CMD: CARD1.3(CMD) U8.21(SD_CM)
SD_D0: CARD1.7(DAT0) U8.19(SD_D0)
SD_D1: CARD1.8(DAT1) U8.18(SD_D1)
SD_D2: CARD1.1(DAT2) U8.23(SD_D2)
SD_D3: CARD1.2(CD/DAT3) U8.22(SD_D3)
SD_VCC: C51.2 CARD1.4(VDD) U8.26(SD_VCC)
SPI_CLK: U8.12(SPI_CK) U9.6(CLK)
SPI_CS: U8.13(SPI_CS) U9.1(CS#)
SPI_MISO: U8.10(SPI_MISO) U9.2(DO(IO1))
SPI_MOSI: U8.11(SPI_MOSI) U9.5(DI(IO0))
SS_HS1_N: U13.8(HSD1-) USB2.2(D-)
SS_HS1_P: U13.7(HSD1+) USB2.3(D+)
SS_HS2_N: U13.75(HSD2-) USB3.2(D-)
SS_HS2_P: U13.74(HSD2+) USB3.3(D+)
SS_HS3_N: U13.66(HSD3-) USB5.A7(DN2) USB5.B7(DN2)
SS_HS3_P: U13.65(HSD3+) USB5.A6(DP1) USB5.B6(DP2)
SS_HS4_N: U8.31(DM) U13.17(HSD4-)
SS_HS4_P: U8.32(DP) U13.16(HSD4+)
SS_RX4_N: R49.1 U8.1(TXN)
SS_RX4_P: R48.1 U8.2(TXP)
SS_TX1_N: C42.1 USB2.8(SSTX-)
SS_TX1_P: C43.1 USB2.9(SSTX+)
SS_TX2_N: C38.2 USB3.8(SSTX-)
SS_TX2_P: C39.2 USB3.9(SSTX+)
SS_TX3_N: C40.2 U10.20(TXN)
SS_TX3_P: C41.2 U10.21(TXP)
SS_TX4_N: C36.1 U8.4(RXN)
SS_TX4_P: C37.1 U8.5(RXP)
SSEQ0: R22.1 U2.38(SSEQ0/A0)
SSEQ1: R23.1 U2.3(SSEQ1)
VHV: C3.2 C56.2 D2.1(K) D3.1(K) Q1.1(S) Q1.2(S) Q1.3(S) Q2.1(S) Q2.2(S) Q2.3(S) R3.2 R4.2 R68.2 U11.2(VIN)
VL817_V11: L1.2 U13.3(VCC11_L1) U13.9(VCCD2) U13.12(VCC11_L4) U13.22(VCCD3) U13.40(VCC11FB) U13.46(VCCD4) U13.49(VCC11_L0) U13.61(VCC11_L3) U13.67(VCCD1) U13.70(VCC11_L2) U13.76(VCC11M)
VL817_V33: U13.6(VCC33_L1) U13.15(VCC33_L4) U13.21(VCC33O) U13.29(VCC33D2) U13.43(VCC33D1) U13.52(VCC33_L0) U13.58(VCC33M) U13.64(VCC33_L3) U13.73(VCC33_L2) U14.3(WP#(IO2)) U14.7(HOLD#(IO3)) U14.8(VCC)
VL817_XI: C35.1 U13.55(SSXI) X1.3(OSC2)
VL817_XO: C34.1 U13.56(SSXO) X1.1(OSC1)
VL_SPI_CLK: U13.34(USBLED2/SPICK) U14.6(CLK)
VL_SPI_CS: U13.32(USBLED4/SPICS) U14.1(CS#)
VL_SPI_SI: U13.35(USBLED1/SPISI) U14.5(DI(IO0))
VL_SPI_SO: U13.33(USBLED3/SPISO) U14.2(DO(IO1))
$1N5269: Q1.4(G) Q3.3(D) R3.1
$1N5274: Q2.4(G) Q4.3(D) R4.1
$1N6115: R16.2 U2.29(EN)
$1N6129: R14.2 U2.23(CTL1)
$1N8230: C2.2 D1.1(K) U1.16(VDD)
$1N8306: C1.2 U1.15(PD_LDO)
$2N1724: C20.2 R26.1
$2N1728: C21.2 R27.1
$2N1988: C29.2 U6.5(BYPASS)
$2N3049: C30.1 U7.8(SS/TR)
$2N3187: R30.1 R31.2 U7.6(FB)
$2N5271: CN1.4 U6.10(OUTL_N)
$2N5276: CN1.3 U6.9(OUTL_P)
$2N5280: CN1.2 U6.8(OUTR_P)
$2N5285: CN1.1 U6.7(OUTR_N)
$3N3626: Q6.1(S) Q6.2(S) Q6.3(S) Q7.1(S) Q7.2(S) Q7.3(S) R59.2
$3N5590: R32.2 U13.36(GPIO2/SMCLK/USBHID)
$3N5594: R33.2 U13.37(GPIO1/SMDAT/USBSUS)
$3N5684: L1.1 U13.39(LX)
$3N5704: C33.2 R34.1 U13.24(RESET#)
$3N5873: R35.2 U13.23(TESTEN)
$3N5942: R36.1 U13.57(SSREXT)
$3N6025: R37.2 R38.1 R39.1
$3N6077: R39.2 U13.45(VBUSDET)
$3N11075: R56.2 U8.9(RTERM)
$3N11079: R57.2 U8.14(LED)
$3N11083: C46.2 U8.24(VUHSI)
$3N11162: LED1.2(A) R57.1
$3N15216: R63.1 U10.10(REXT)
$3N15220: R64.1 U10.13(High_Z)
$3N15671: Q5.3(D) Q6.4(G) Q7.4(G) R59.1
$3N15749: Q5.1(G) R58.2 U10.16(Attached_Status)
$4N717: R67.2 R68.1 U11.7(EN)
$4N833: D6.1(K) L2.1 U11.3(SW)
$4N1195: R69.2 R70.1 U11.5(FB)
$4N1613: C59.1 U17.8(SS/TR)
$4N1817: R71.1 R72.2 U17.6(FB)
Net-(C16-2): C16.2 C17.2

Not connected (* = marked no-connect by the designer): C18 2; U2 1(NC)*; U3 1(D0) 2(SCLK) 3(WS) 4(MCLK) 5(VQ) 6(FILT+) 7(AOUTL) 8(GND) 9(VA) 10(AOUTR); U6 3(MODE)*; U7 7(PG)*; U10 11(Vconn_OC)* 12(Vconn_UVLO)* 14(CurrentSettingout)* 15(CurrentSettingout)* 22(ORI_STATUS)*; U11 1(NC)* 6(NC)* 8(NC)*; U13 30(GPIOB)* 31(GPIOA)* 44(EXTPWRON)*; U17 7(PG)*; USB4 A6(DP1)* A7(DN1)* A8(SBU1)* B6(DP2)* B7(DN2)* B8(SBU2)*; USB5 A8(SUB1)* B8(SUB2)*; X1 2 4; X2 2 4

## Notes on the sheets
sheet 1
- TYPE-C C0&MUX
- TYPE-C C1
- ADC: 20K/3K
  DET:  36K/12K
- GND: LEVEL 0
  20K-GND: LEVEL R
  FLOAT: LEVEL F
  3V3: LEVEL 1
- POL: 0-No Flip
  POL: 1-With Flip
  SEL: 0-4 Lane DP
  SEL: 1-2 Lane DP
- PD CONTROL MCU
- POWER PATH
sheet 2
- DP IIS SPEAKER
sheet 3
- USB4 SD CARD
- USB HUB
- usb3 vl162 typec
- USB1 TypeA
sheet 4
- VHV -> 5V
- 3.3V @ 2A
